# Altium schematic sheet 理想二极管.SchDoc
size A3
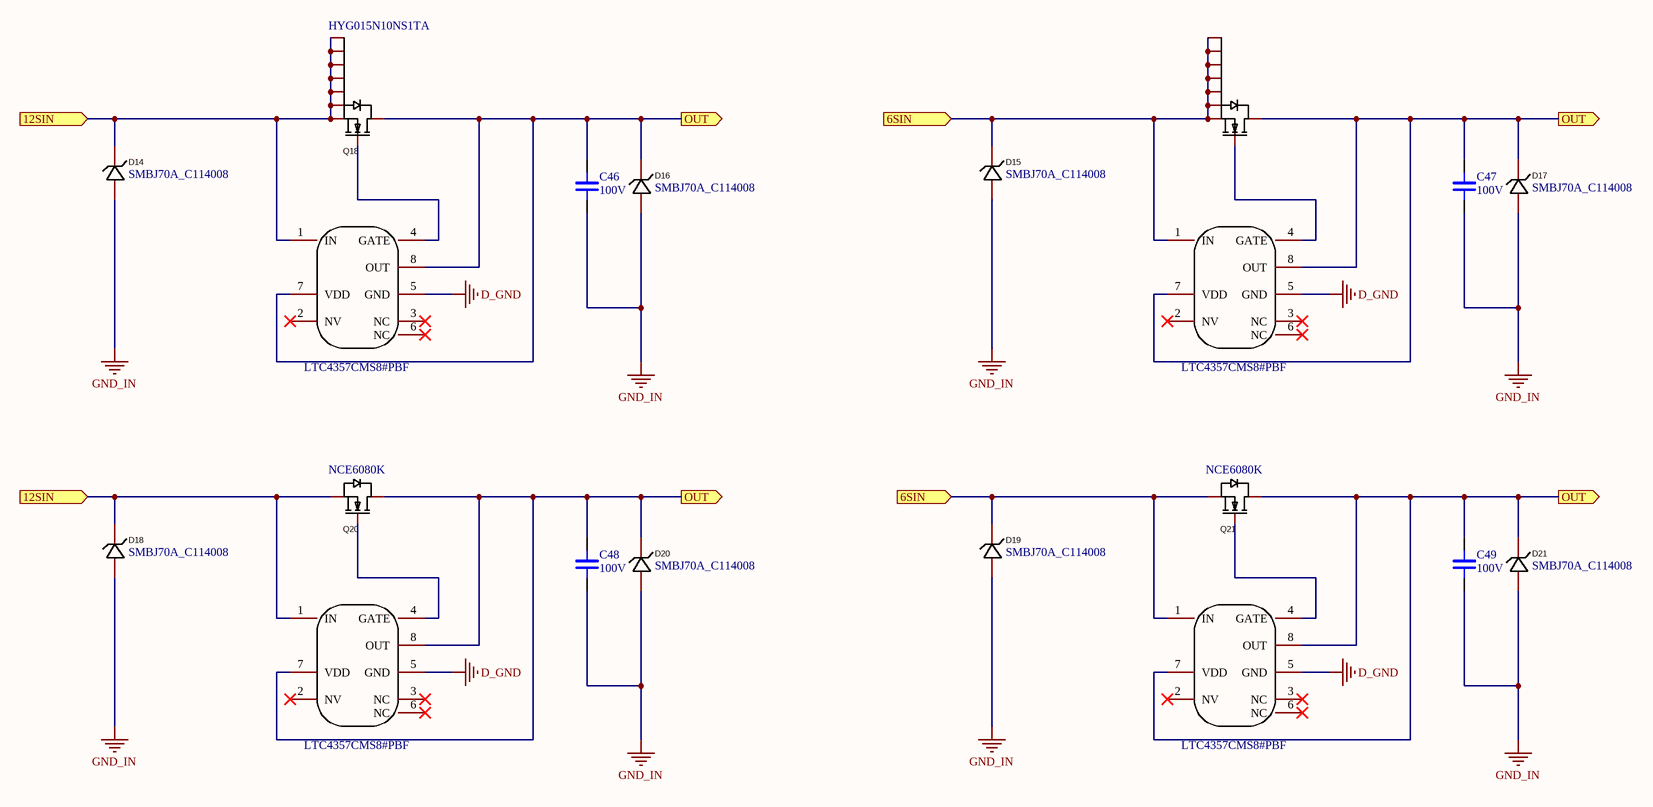
[diagram p0: 理想二极管.SchDoc]

## Parts
C46  100V  [C 1210_L]
C47  100V  [C 1210_L]
C48  100V  [C 1210_L]
C49  100V  [C 1210_L]
D14  SMBJ70A_C114008  [SMB_L4.6-W3.6-LS5.3-RD]
D15  SMBJ70A_C114008  [SMB_L4.6-W3.6-LS5.3-RD]
D16  SMBJ70A_C114008  [SMB_L4.6-W3.6-LS5.3-RD]
D17  SMBJ70A_C114008  [SMB_L4.6-W3.6-LS5.3-RD]
D18  SMBJ70A_C114008  [SMB_L4.6-W3.6-LS5.3-RD]
D19  SMBJ70A_C114008  [SMB_L4.6-W3.6-LS5.3-RD]
D20  SMBJ70A_C114008  [SMB_L4.6-W3.6-LS5.3-RD]
D21  SMBJ70A_C114008  [SMB_L4.6-W3.6-LS5.3-RD]
Q18  HYG015N10NS1TA  [TOLL-8_L10.4-W9.9-P1.20-LS11.7-BL]
Q19  HYG015N10NS1TA  [TOLL-8_L10.4-W9.9-P1.20-LS11.7-BL]  (value not drawn)
Q20  NCE6080K  [TO-252-2_L6.6-W6.1-P4.57-LS10.1-BR-CW]
Q21  NCE6080K  [TO-252-2_L6.6-W6.1-P4.57-LS10.1-BR-CW]
U10  LTC4357CMS8#PBF  [MSOP-8_L3.0-W3.0-P0.65-LS4.9-BL]
U11  LTC4357CMS8#PBF  [MSOP-8_L3.0-W3.0-P0.65-LS4.9-BL]
U12  LTC4357CMS8#PBF  [MSOP-8_L3.0-W3.0-P0.65-LS4.9-BL]
U13  LTC4357CMS8#PBF  [MSOP-8_L3.0-W3.0-P0.65-LS4.9-BL]

## Ports
6SIN (in), 12SIN (in), OUT (out)

## Nets
D_GND: U10.5(GND) U11.5(GND) U12.5(GND) U13.5(GND)
GND_IN: C46.2 C47.2 C48.2 C49.2 D14.2(A) D15.2(A) D16.2(A) D17.2(A) D18.2(A) D19.2(A) D20.2(A) D21.2(A)
6SIN: D15.1(C) D19.1(C) Q19.2(S) Q19.3(S) Q19.4(S) Q19.5(S) Q19.6(S) Q19.7(S) Q19.8(S) Q21.3(S) U11.1(IN) U13.1(IN) ; port 6SIN
12SIN: D14.1(C) D18.1(C) Q18.2(S) Q18.3(S) Q18.4(S) Q18.5(S) Q18.6(S) Q18.7(S) Q18.8(S) Q20.3(S) U10.1(IN) U12.1(IN) ; port 12SIN
OUT: C46.1 C47.1 C48.1 C49.1 D16.1(C) D17.1(C) D20.1(C) D21.1(C) Q18.9(D) Q19.9(D) Q20.2(D) Q21.2(D) U10.7(VDD) U10.8(OUT) U11.7(VDD) U11.8(OUT) U12.7(VDD) U12.8(OUT) U13.7(VDD) U13.8(OUT) ; port OUT
NetQ18_1: Q18.1(G) U10.4(GATE)
NetQ19_1: Q19.1(G) U11.4(GATE)
NetQ20_1: Q20.1(G) U12.4(GATE)
NetQ21_1: Q21.1(G) U13.4(GATE)

Not connected (* = marked no-connect by the designer): U10 2(NV)* 3(NC)* 6(NC)*; U11 2(NV)* 3(NC)* 6(NC)*; U12 2(NV)* 3(NC)* 6(NC)*; U13 2(NV)* 3(NC)* 6(NC)*

## Library data of the parts
C46-C49 = CAP: 陶瓷电容
D14-D21 = SMBJ70A_C114008: Manufacturer: MDD; Add into BOM: yes; Polarity: 单向; Reverse Stand-Off Voltage (Vrwm): 70V; Breakdown Voltage: 77.8V; Peak Pulse Current (Ipp)@10/1000μs: 5.3A; Maximum Clamping Voltage: 113V; Name: SMBJ70A; Symbol: SMBJ70A; Device: SMBJ70A_C114008; LCSC Part Name: 单向TVS 70V截止 5.3A峰值脉冲; Supplier Part: C114008; Manufacturer Part: SMBJ70A; Supplier Footprint: SMB(DO-214AA); JLCPCB Part Class: Extended Part; Datasheet: https://atta.szlcsc.com/upload/public/pdf/source/20230314/C8F66EF07395B88C11214ABD10019202.pdf; Supplier: LCSC; Convert to PCB: yes
Q18 Q19 = HYG015N10NS1TA: Manufacturer: HUAYI(华羿微); Add into BOM: yes; Type: N沟道; Drain Source Voltage (Vdss): 100V; Continuous Drain Current (Id): 380A; Power Dissipation (Pd): 428.5W; Drain Source On Resistance (RDS(on)@Vgs,Id): 1.2mΩ@10V,100A; Gate Threshold Voltage (Vgs(th)@Id): 3V@250uA; Total Gate Charge (Qg@Vgs): 205nC@10V; Input Capacitance (Ciss@Vds): 12.3nF@25V; Reverse Transfer Capacitance (Crss@Vds): 250pF@25V; Name: HYG015N10NS1TA; Symbol: HYG015N10NS1TA; Device: HYG015N10NS1TA; LCSC Part Name: N沟道 100V 380A; Supplier Part: C2979263; Manufacturer Part: HYG015N10NS1TA; Supplier Footprint: TOLL-8; JLCPCB Part Class: Extended Part; Datasheet: https://atta.szlcsc.com/upload/public/pdf/source/20220303/83427DBE0CDF10F23F3FDD49B9C9CFAE.pdf; Supplier: LCSC; Convert to PCB: yes; Operating Temperature: -55℃~+175℃@(Tj)
Q20 Q21 = NCE6080K: Manufacturer: NCE(无锡新洁能); Add into BOM: yes; Type: N沟道; Drain Source Voltage (Vdss): 60V; Continuous Drain Current (Id): 80A; Power Dissipation (Pd): 110W; Drain Source On Resistance (RDS(on)@Vgs,Id): 8.5mΩ@10V,20A; Gate Threshold Voltage (Vgs(th)@Id): 4V@250uA; Name: NCE6080K; Symbol: NCE6080K; Device: NCE6080K; LCSC Part Name: N沟道 60V 80A; Supplier Part: C341705; Manufacturer Part: NCE6080K; Supplier Footprint: TO-252-2; JLCPCB Part Class: Extended Part; Datasheet: https://atta.szlcsc.com/upload/public/pdf/source/20181205/C341705_A98BB2E94DE599C81CD1E648BE453360.pdf; Supplier: LCSC; Convert to PCB: yes
U10-U13 = LTC4357CMS8#PBF: Manufacturer: ADI(亚德诺)/LINEAR(凌特); Add into BOM: yes; Name: LTC4357CMS8#PBF; Symbol: LTC4357CMS8#PBF; Device: LTC4357CMS8#PBF; LCSC Part Name: LTC4357CMS8#PBF; Supplier Part: C107961; Manufacturer Part: LTC4357CMS8#PBF; Supplier Footprint: MSOP-8; JLCPCB Part Class: Extended Part; Datasheet: https://atta.szlcsc.com/upload/public/pdf/source/20170413/1492062869392.pdf; Supplier: LCSC; Convert to PCB: yes